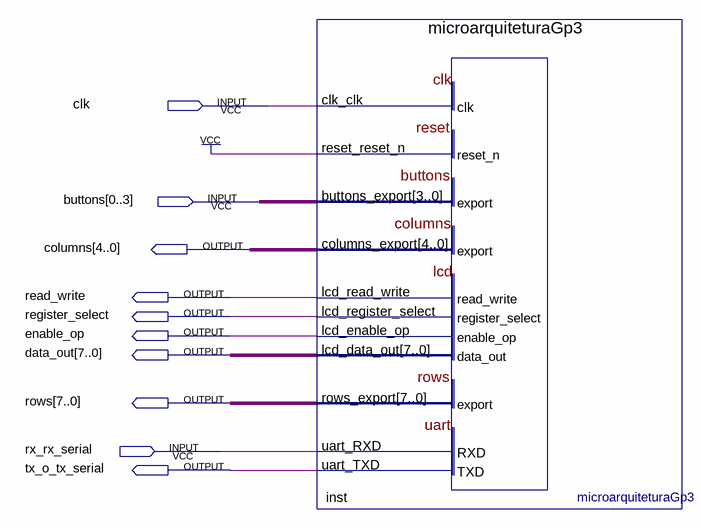
[diagram p0: schematic sheet]
// Quartus schematic microarquiteturaGp3.bdf as structural Verilog: 1 symbols, 10 pins
module microarquiteturaGp3 (
  input  clk,
  input  [0:3] buttons,
  input  rx_rx_serial,
  output [4:0] columns,
  output read_write,
  output register_select,
  output enable_op,
  output [7:0] data_out,
  output [7:0] rows,
  output tx_o_tx_serial
);

  microarquiteturaGp3 inst (
    .clk_clk(clk), .reset_reset_n(1'b1), .buttons_export(buttons), .uart_RXD(rx_rx_serial),
    .columns_export(columns), .lcd_read_write(read_write), .lcd_register_select(register_select),
    .lcd_enable_op(enable_op), .lcd_data_out(data_out), .rows_export(rows), .uart_TXD(tx_o_tx_serial));
endmodule
